# Altium schematic sheet Power.SchDoc
size A4; SheetNumber: 2; SheetTotal: 2
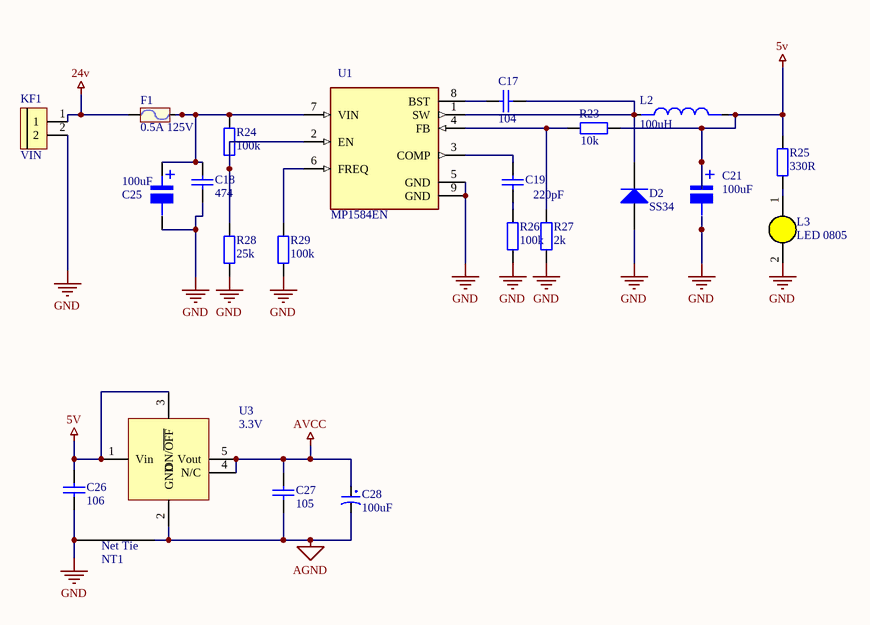
[diagram p0: Power.SchDoc]

## Parts
C17  104  [tu 0603]
C18  474  [tu 0805]
C19  220pF  [tu 0603]
C21  100uF  [tu nhom 6.3 (d)]
C25  100uF  [tu nhom 10 (g)]
C26  106  [tu 0603]
C27  105  [tu 0603]
C28  100uF  [tu tantalum smd3528]
D2  SS34  [DIODE SMA]
F1  0.5A 125V  [Cau Chi SMD1808]
KF1  VIN  [Con 2 KF301 5.08]
L2  100uH  [CUON CAM SMD 0530]
L3  LED 0805  [LED-0805-Yellow]
NT1  2mm  [NetTie_20mil]  (value not drawn)  (net tie, no BOM)
R23  10k  [tro smd 0603]
R24  100k  [tro smd 0603]
R25  330R  [tro smd 0603]
R26  100k  [tro smd 0603]
R27  2k  [tro smd 0603]
R28  25k  [tro smd 0603]
R29  100k  [tro smd 0603]
U1  MP1584EN  [SOIC127P600X170-9N]
U3  3.3V  [SOT23-5]

## Nets
5v: C21.1 C26.1 L2.2 R23.2 R25.2 U3.1(Vin) U3.3(ON/~{OFF})
24v: F1.1 KF1.1
AGND: C27.2 C28.2 NT1.2 U3.2(GND)
AVCC: C27.1 C28.1 U3.4(N/C) U3.5(Vout)
GND: C18.2 C21.2 C25.2 C26.2 D2.1(A) KF1.2 L3.2(K) NT1.1 R26.1 R27.1 R28.1 R29.1 U1.5(GND) U1.9(GND)
NetC17_1: C17.1 D2.2(K) L2.1 U1.1(SW)
NetC17_2: C17.2 U1.8(BST)
NetC18_1: C18.1 C25.1 F1.2 R24.2 U1.7(VIN)
NetC19_1: C19.1 U1.3(COMP)
NetC19_2: C19.2 R26.2
NetL3_1: L3.1(A) R25.1
NetR23_1: R23.1 R27.2 U1.4(FB)
NetR24_1: R24.1 R28.2 U1.2(EN)
NetR29_2: R29.2 U1.6(FREQ)

## Notes on the sheet
- (in symbol NetTie_2mm) Net Tie
- (in symbol Tu Nhom 100uF 16V) +
- (in symbol Tu Nhom 100uF 35V) +

## Library data of the parts
C17 = Tu 0603 104 50V 10%: Dán; Don_Vi: Con; So_Chan: 2; Ten_Linh_Kien: Tụ 0603 104-100nF 10% 50V; Ma_Hang: MH004568; Chung_Loai: Dán; Kieu_Chan: *
C18 = Tu 0805 474 50V 10%: Dán; Don_Vi: Con; So_Chan: 2; Ten_Linh_Kien: Tụ 0805 474-470nF 50V 10%; Ma_Hang: MH006116; Chung_Loai: Dán; Kieu_Chan: *
C19 = Tu 0603 22pF 50V 10%: Dán; Don_Vi: Con; So_Chan: 2; Ten_Linh_Kien: Tụ 0603 22pF 50V 10%; Ma_Hang: MH004570; Chung_Loai: Dán; Kieu_Chan: *
C21 = Tu Nhom 100uF 16V: Dán; Don_Vi: Con; So_Chan: 2; Ten_Linh_Kien: Tụ Nhôm 100uF 16V 6.3x5.4MM; Ma_Hang: MH002219; Chung_Loai: Dán; Kieu_Chan: *
C25 = Tu Nhom 100uF 35V: Dán; Don_Vi: Con; Ten_Linh_Kien: Tụ Nhôm 100uF 35V; Ma_Hang: MH004019; So_Chan: 2; Chung_Loai: Dán; Kieu_Chan: *
C26 C27 = Tu 0603 106 16V 20%: Dán; Don_Vi: Con; So_Chan: 2; Ten_Linh_Kien: Tụ 0603-10uF 20% 16V; Ma_Hang: MH004848; Chung_Loai: Dán; Kieu_Chan: *
C28 = Tu tantalum 100uF 6.3V SMD3528: Dán; Don_Vi: Con; So_Chan: 2; Ten_Linh_Kien: Tụ tantalum 107J-100uF 6.3V SMD3528; Ma_Hang: MH007595; Chung_Loai: Dán; Kieu_Chan: *
D2 = Diode SS34 ( 1N5822 ): Dán; Don_Vi: Con; Ma_Hang: MH002104; Ten_Linh_Kien: Diode SS34 3A 40V SMA ( 1N5822 SS34A); Kieu_Chan: *; Chung_Loai: Dán
F1 = Cau chi 0.5A 125V SMD1808: Ma_Hang: MH009241; Ten: Cầu Chì 0.5A 125V SMD1808 0451.500MRL
KF1 = CON 2 KF301: Cắm; Ma_Hang: MH000987; Ten_Linh_Kien: CON 2 KF301-2P 5.08MM Xanh Dương; Don_Vi: Con; Chung_Loai: Cắm; Ghi_Chu: *; Kieu_Chan: *
L2 = Cuon Cam SMD 0530: SMD 0530; MP: FDV0530-H-1R5M=P3; Package: None; Price: None; Value: *; Availability: Unavailable
L3 = LED 0805 Vang: Dán; Don_Vi: Con; Ma_Hang: MH002329; Ten_Linh_Kien: LED 0805 Màu Vàng ( Yellow); Ghi_Chu: *; Kieu_Chan: *; Chung_Loai: Dán
NT1 = NetTie_2mm
R23 R27 = Tro 0603 5% 510R: Dán; Don_Vi: Con; So_Chan: 2; Ten_Linh_Kien: Trở 0603 5% 510R; Ma_Hang: MH007667; Chung_Loai: Dán; Kieu_Chan: *
R24 R26 R28 R29 = Tro 0603 5% 100k: Dán; So_Chan: 2; Ten_Linh_Kien: Trở 0603 5% 100k; Ma_Hang: MH006314; Don_Vi: Con; Chung_Loai: Dán; Kieu_Chan: *
R25 = Tro 0603 5% 330R: Dán; Don_Vi: Con; Ma_Hang: MH006910; So_Chan: 2; Ten_Linh_Kien: Trở 0603 5% 330R; Chung_Loai: Dán; Kieu_Chan: *
U1 = MP1584EN: Buck Switching Regulator IC Positive Adjustable 0.8V 1 Output 3A 8-SOIC (0.154, 3.90mm Width) Exposed Pad; MF: Monolithic Power; Value: *; SnapEDA_Link: https://www.snapeda.com/parts/MP1584EN/Monolithic+Power+Systems+Inc./view-part/?ref=snap; MP: MP1584EN; Purchase-URL: https://pricing.snapeda.com/search/part/MP1584EN/?ref=eda; Check_prices: https://www.snapeda.com/parts/MP1584EN/Monolithic+Power+Systems+Inc./view-part/?ref=eda; Availability: In Stock; Price: None; Package: SOIC-8 Monolithic Power
U3 = LP5907MFX-3.3/NOPB: IC REG LDO 3.3V 0.25A SOT23-5; Manufacturer: Texas Instruments; Regulator Topology: Positive Fixed; Current - Output: 250mA; Voltage - Input: Up to 5.5V; Supplier 1: Digi-Key; Supplier Part Number 1: 296-38557-1-ND; RoHS: RoHS Compliant; Category: Integrated Circuits (ICs); Stock 1: 39845; Pricing 1: 1=0.57, 10=0.487, 100=0.3634, 500=0.28552, 1000=0.22063 (USD); Packaging: Cut Tape (CT); Part Status: Active; Voltage - Output: 3.3V; Voltage - Dropout (Typical): -; Current - Limit (Min): -; Operating Temperature: -40°C ~ 125°C; Mounting Type: Surface Mount; Package / Case: SC-74A, SOT-753; Supplier Device Package: SOT-23; ComponentLink1URL: http://www.ti.com/lit/ds/symlink/lp5907.pdf; ComponentLink1Description: http://www.ti.com/lit/ds/symlink/lp5907.pdf